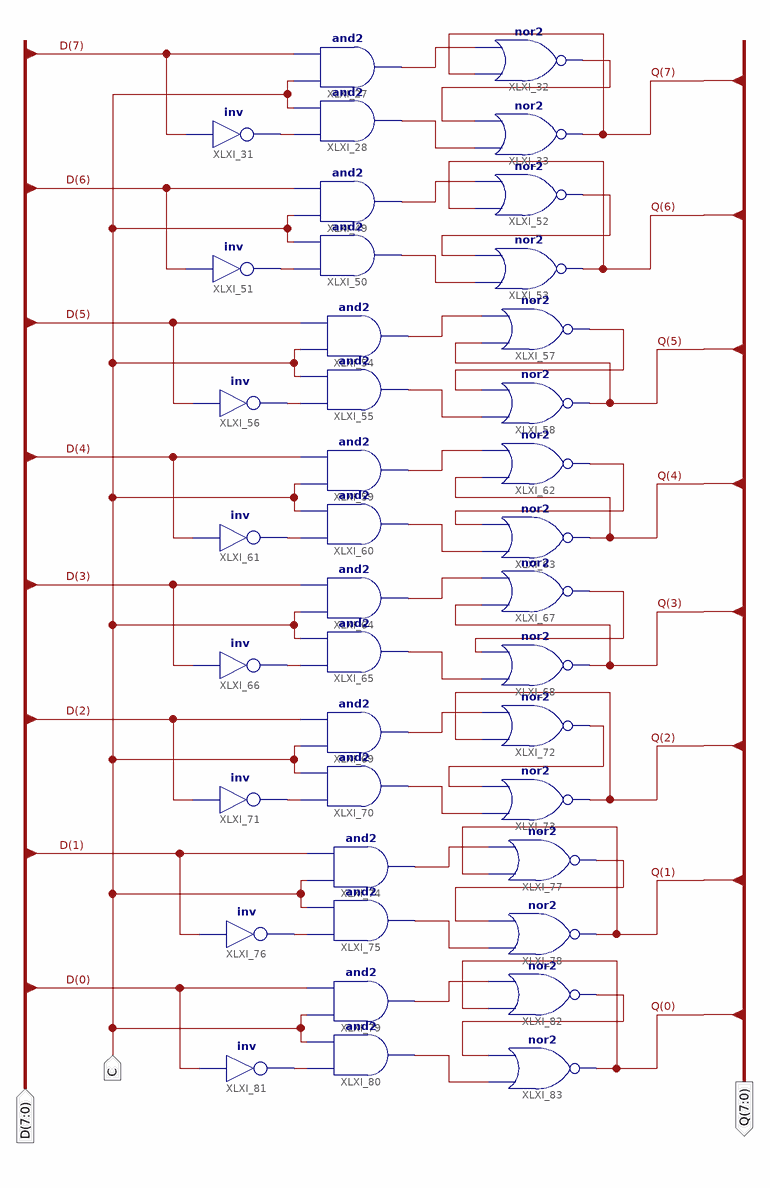
[diagram p0: schematic sheet 1]
// Xilinx ISE schematic eightRegisters.sch (spartan3e) as structural Verilog: 40 symbols, 3 ports
module eightRegisters (
  input  C,
  input  [7:0] D,
  output [7:0] Q
);

  wire XLXN_74, XLXN_76, XLXN_77, XLXN_109, XLXN_111, XLXN_112, XLXN_118, XLXN_120, XLXN_121, XLXN_127,
       XLXN_129, XLXN_130, XLXN_136, XLXN_138, XLXN_139, XLXN_145, XLXN_147, XLXN_148, XLXN_154, XLXN_156,
       XLXN_157, XLXN_163, XLXN_165, XLXN_166, XLXN_182, XLXN_183, XLXN_184, XLXN_185, XLXN_186, XLXN_187,
       XLXN_188, XLXN_189;

  and XLXI_27 (XLXN_76, C, D[7]);
  and XLXI_28 (XLXN_77, XLXN_74, C);
  not XLXI_31 (XLXN_74, D[7]);
  nor XLXI_32 (XLXN_188, Q[7], XLXN_76);
  nor XLXI_33 (Q[7], XLXN_77, XLXN_188);
  and XLXI_49 (XLXN_111, C, D[6]);
  and XLXI_50 (XLXN_112, XLXN_109, C);
  not XLXI_51 (XLXN_109, D[6]);
  nor XLXI_52 (XLXN_187, Q[6], XLXN_111);
  nor XLXI_53 (Q[6], XLXN_112, XLXN_187);
  and XLXI_54 (XLXN_120, C, D[5]);
  and XLXI_55 (XLXN_121, XLXN_118, C);
  not XLXI_56 (XLXN_118, D[5]);
  nor XLXI_57 (XLXN_186, Q[5], XLXN_120);
  nor XLXI_58 (Q[5], XLXN_121, XLXN_186);
  and XLXI_59 (XLXN_129, C, D[4]);
  and XLXI_60 (XLXN_130, XLXN_127, C);
  not XLXI_61 (XLXN_127, D[4]);
  nor XLXI_62 (XLXN_185, Q[4], XLXN_129);
  nor XLXI_63 (Q[4], XLXN_130, XLXN_185);
  and XLXI_64 (XLXN_138, C, D[3]);
  and XLXI_65 (XLXN_139, XLXN_136, C);
  not XLXI_66 (XLXN_136, D[3]);
  nor XLXI_67 (XLXN_189, Q[3], XLXN_138);
  nor XLXI_68 (Q[3], XLXN_139, XLXN_189);
  and XLXI_69 (XLXN_147, C, D[2]);
  and XLXI_70 (XLXN_148, XLXN_145, C);
  not XLXI_71 (XLXN_145, D[2]);
  nor XLXI_72 (XLXN_184, Q[2], XLXN_147);
  nor XLXI_73 (Q[2], XLXN_148, XLXN_184);
  and XLXI_74 (XLXN_156, C, D[1]);
  and XLXI_75 (XLXN_157, XLXN_154, C);
  not XLXI_76 (XLXN_154, D[1]);
  nor XLXI_77 (XLXN_183, Q[1], XLXN_156);
  nor XLXI_78 (Q[1], XLXN_157, XLXN_183);
  and XLXI_79 (XLXN_165, C, D[0]);
  and XLXI_80 (XLXN_166, XLXN_163, C);
  not XLXI_81 (XLXN_163, D[0]);
  nor XLXI_82 (XLXN_182, Q[0], XLXN_165);
  nor XLXI_83 (Q[0], XLXN_166, XLXN_182);
endmodule
